# Altium schematic sheet Schematic.SchDoc: ADC Breakout to BNC
size Letter; Engineer: Nathan Petersen; SheetNumber: 1; SheetTotal: 1
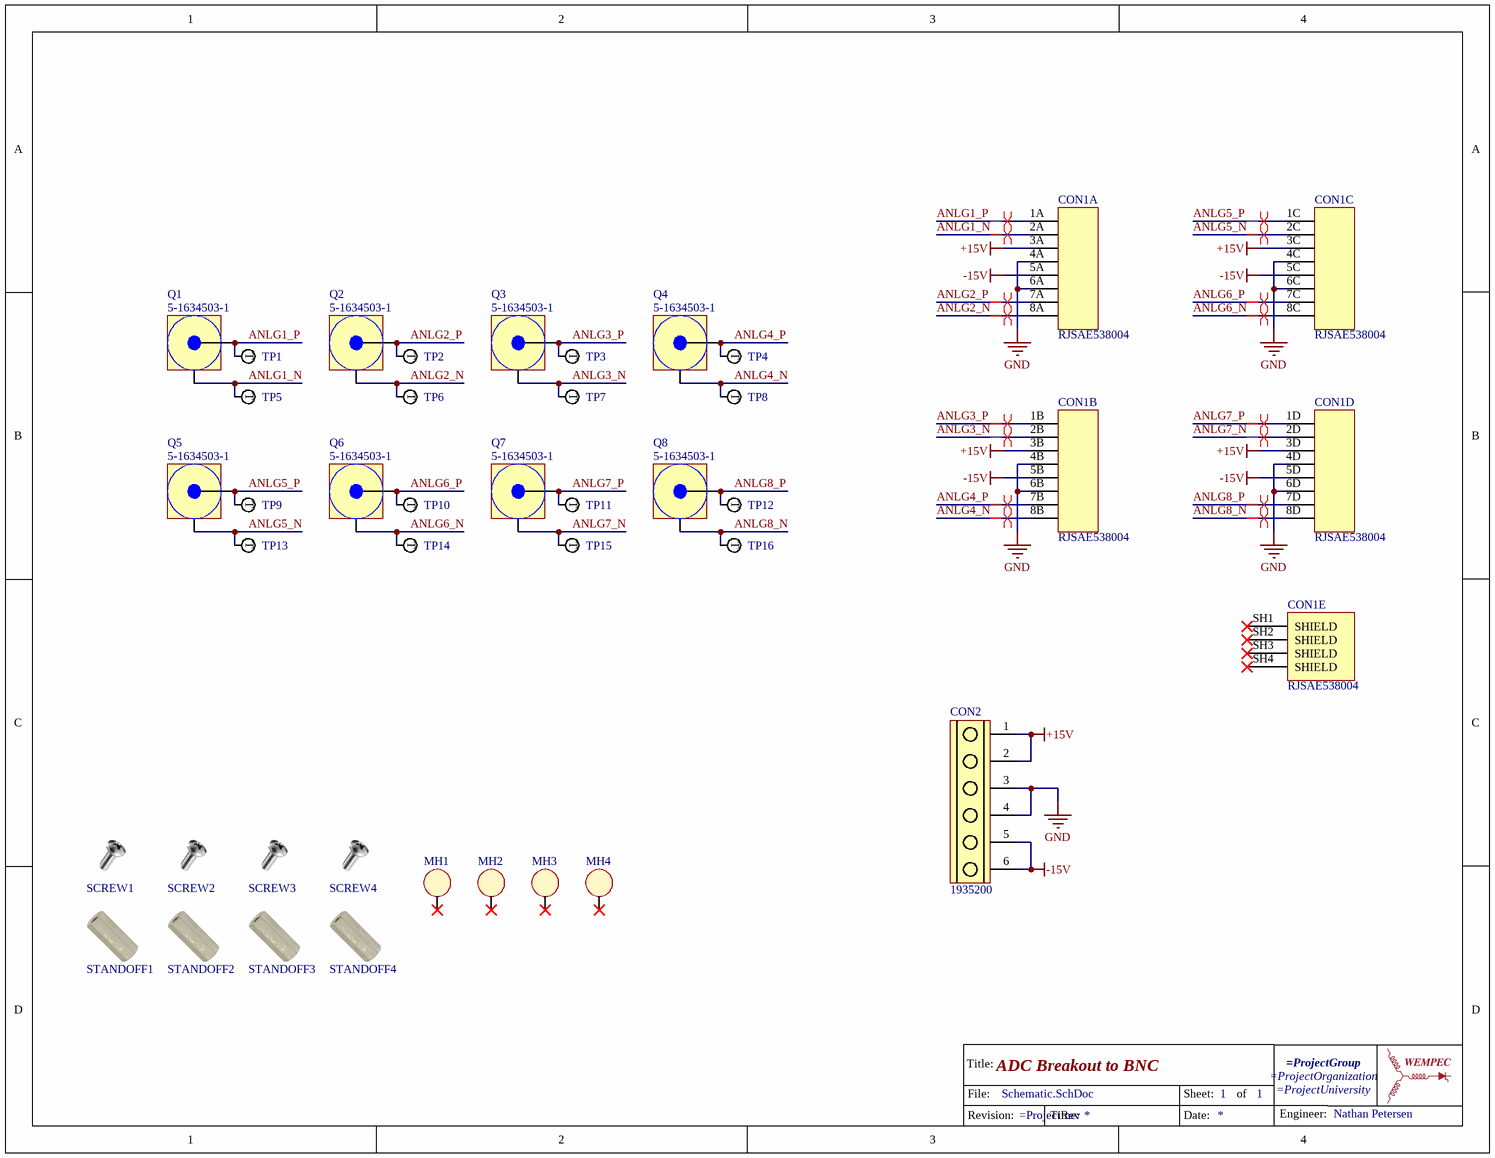
[diagram p0: Schematic.SchDoc]

## Parts
*1  TitleBlockWEMPEC  (value not drawn)  (graphical)
CON1  RJSAE538004  [RJSAE538004]  (parts A,B,C,D,E of 5)
CON2  1935200  [1935200]
MH1  MOUNT_HOLE  [MOUNTING_HOLE]  (value not drawn)  (no BOM)
MH2  MOUNT_HOLE  [MOUNTING_HOLE]  (value not drawn)  (no BOM)
MH3  MOUNT_HOLE  [MOUNTING_HOLE]  (value not drawn)  (no BOM)
MH4  MOUNT_HOLE  [MOUNTING_HOLE]  (value not drawn)  (no BOM)
Q1  5-1634503-1  [5-1634503-1]
Q2  5-1634503-1  [5-1634503-1]
Q3  5-1634503-1  [5-1634503-1]
Q4  5-1634503-1  [5-1634503-1]
Q5  5-1634503-1  [5-1634503-1]
Q6  5-1634503-1  [5-1634503-1]
Q7  5-1634503-1  [5-1634503-1]
Q8  5-1634503-1  [5-1634503-1]
SCREW1  Screw-4-40  (value not drawn)  (mechanical)
SCREW2  Screw-4-40  (value not drawn)  (mechanical)
SCREW3  Screw-4-40  (value not drawn)  (mechanical)
SCREW4  Screw-4-40  (value not drawn)  (mechanical)
STANDOFF1  Standoff-4-40  (value not drawn)  (mechanical)
STANDOFF2  Standoff-4-40  (value not drawn)  (mechanical)
STANDOFF3  Standoff-4-40  (value not drawn)  (mechanical)
STANDOFF4  Standoff-4-40  (value not drawn)  (mechanical)
TP1  Test Point  [TP_1.6MM]  (value not drawn)
TP2  Test Point  [TP_1.6MM]  (value not drawn)
TP3  Test Point  [TP_1.6MM]  (value not drawn)
TP4  Test Point  [TP_1.6MM]  (value not drawn)
TP5  Test Point  [TP_1.6MM]  (value not drawn)
TP6  Test Point  [TP_1.6MM]  (value not drawn)
TP7  Test Point  [TP_1.6MM]  (value not drawn)
TP8  Test Point  [TP_1.6MM]  (value not drawn)
TP9  Test Point  [TP_1.6MM]  (value not drawn)
TP10  Test Point  [TP_1.6MM]  (value not drawn)
TP11  Test Point  [TP_1.6MM]  (value not drawn)
TP12  Test Point  [TP_1.6MM]  (value not drawn)
TP13  Test Point  [TP_1.6MM]  (value not drawn)
TP14  Test Point  [TP_1.6MM]  (value not drawn)
TP15  Test Point  [TP_1.6MM]  (value not drawn)
TP16  Test Point  [TP_1.6MM]  (value not drawn)

## Nets
+15V: CON1.3A CON1.3B CON1.3C CON1.3D CON2.1 CON2.2
-15V: CON1.5A CON1.5B CON1.5C CON1.5D CON2.5 CON2.6
GND: CON1.4A CON1.4B CON1.4C CON1.4D CON1.6A CON1.6B CON1.6C CON1.6D CON2.3 CON2.4
ANLG1_N: CON1.2A Q1.2 TP5.1
ANLG1_P: CON1.1A Q1.1 TP1.1
ANLG2_N: CON1.8A Q2.2 TP6.1
ANLG2_P: CON1.7A Q2.1 TP2.1
ANLG3_N: CON1.2B Q3.2 TP7.1
ANLG3_P: CON1.1B Q3.1 TP3.1
ANLG4_N: CON1.8B Q4.2 TP8.1
ANLG4_P: CON1.7B Q4.1 TP4.1
ANLG5_N: CON1.2C Q5.2 TP13.1
ANLG5_P: CON1.1C Q5.1 TP9.1
ANLG6_N: CON1.8C Q6.2 TP14.1
ANLG6_P: CON1.7C Q6.1 TP10.1
ANLG7_N: CON1.2D Q7.2 TP15.1
ANLG7_P: CON1.1D Q7.1 TP11.1
ANLG8_N: CON1.8D Q8.2 TP16.1
ANLG8_P: CON1.7D Q8.1 TP12.1

Not connected (* = marked no-connect by the designer): CON1 SH1(SHIELD)* SH2(SHIELD)* SH3(SHIELD)* SH4(SHIELD)*; MH1 1*; MH2 1*; MH3 1*; MH4 1*

## Layout directives
differential pair: ANLG1_N, ANLG1_P, ANLG2_N, ANLG2_P, ANLG3_N, ANLG3_P, ANLG4_N, ANLG4_P, ANLG5_N, ANLG5_P, ANLG6_N, ANLG6_P, ANLG7_N, ANLG7_P, ANLG8_N, ANLG8_P

## Notes on the sheet
- (in symbol Test Point) T
- (in symbol TitleBlockWEMPEC) Title:; File:; Sheet:; of; Engineer:; Revision:; Time:; Date:

## Library data of the parts
CON1 = RJSAE538004: CONN MOD JACK 8P8C R/A SHIELDED; Supplier 1: Digi-Key; Supplier Part Number 1: RJSAE538004-ND
CON2 = 1935200: TERM BLK 6POS SIDE ENTRY 5MM PCB; Supplier 1: Digi-Key; Supplier Part Number 1: 277-1581-ND
MH1-MH4 = MOUNT_HOLE: MOUNTING HOLE
Q1-Q8 = 5-1634503-1: BNC Connector Jack, Female Socket 50 Ohm Through Hole Solder; Supplier 1: Digi-Key; Supplier Part Number 1: A97581-ND
SCREW1-SCREW4 = Screw-4-40: Supplier 1: Digi-Key; Supplier Part Number 1: KEY1046-ND
STANDOFF1-STANDOFF4 = Standoff-4-40: Supplier 1: Digi-Key; Supplier Part Number 1: 36-1656-ND
TP1-TP16 = Test Point: Supplier 1: Digi-Key; Supplier Part Number 1: 36-680-ND